# Altium schematic sheet MCUboard.SchDoc
size A; SheetNumber: 1; SheetTotal: 3
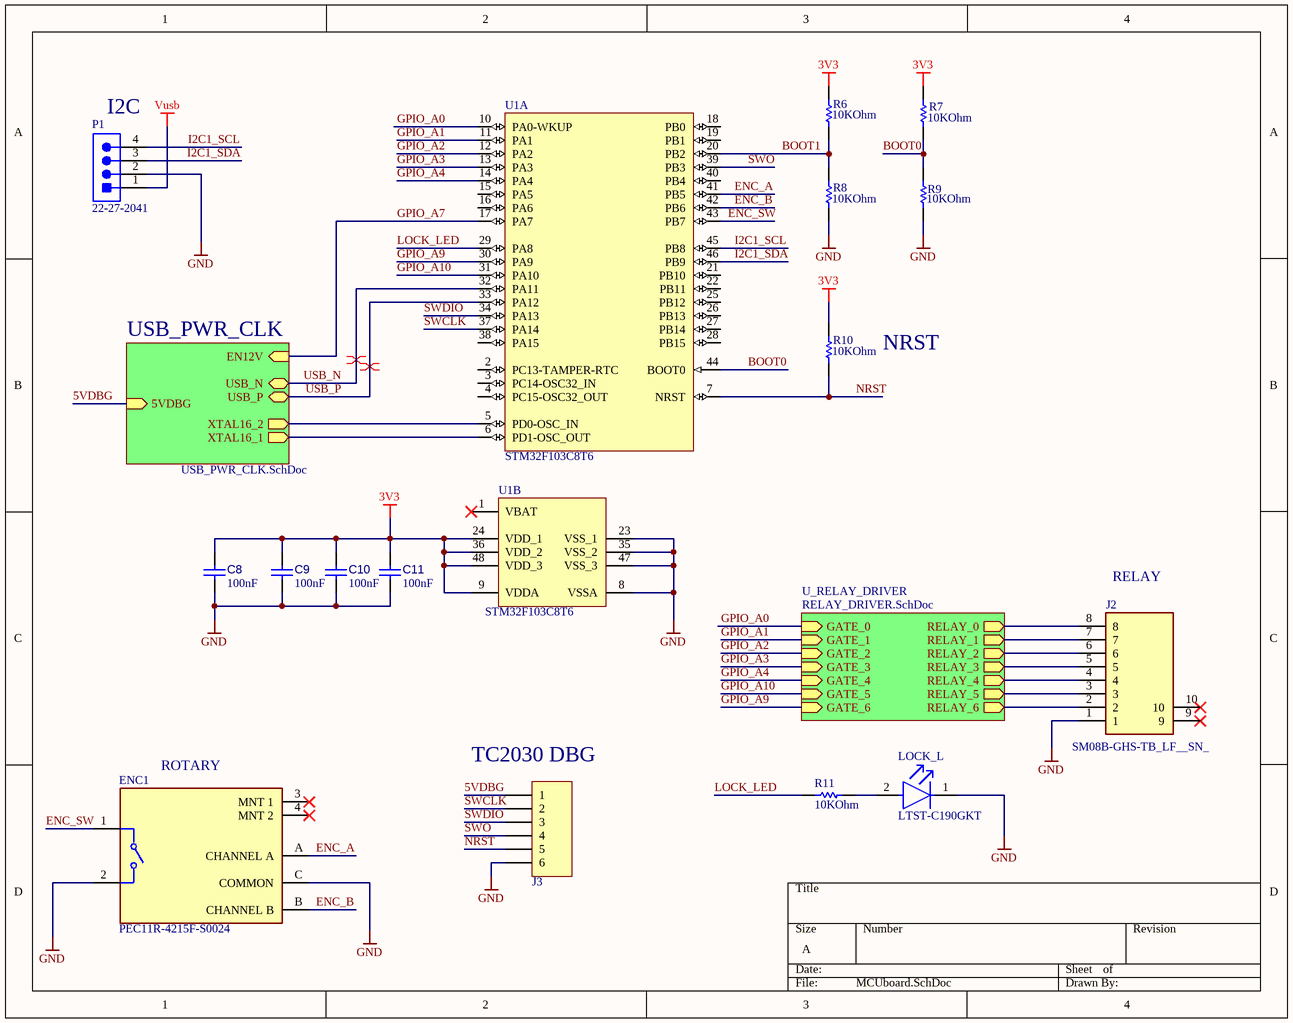
[diagram p0: MCUboard.SchDoc]

## Parts
C8  value 100nF  [CAPC1608X90X40NL10T20]  (hidden comment: Capacitor 100 nF +/-10% 50 V 0603)
C9  value 100nF  [CAPC1608X90X40NL10T20]  (hidden comment: Capacitor 100 nF +/-10% 50 V 0603)
C10  value 100nF  [CAPC1608X90X40NL10T20]  (hidden comment: Capacitor 100 nF +/-10% 50 V 0603)
C11  value 100nF  [CAPC1608X90X40NL10T20]  (hidden comment: Capacitor 100 nF +/-10% 50 V 0603)
ENC1  PEC11R-4215F-S0024  [FP-PEC11R-4215F-S0024-MFG]
J2  SM08B-GHS-TB_LF__SN_  [SM08BGHSTBLFSN]
J3  ICSP  [TC2030-MCP-NL]  (value not drawn)
LOCK_L  LTST-C190GKT  [FP-LTST-C190GKT-MFG]
P1  22-27-2041  [MOLX-22-27-2041_V]
R6  Resistance: 10KOhm  [RESC1609X55X30LL15T15]  (hidden comment: ERJ3EKF1002V)
R7  Resistance: 10KOhm  [RESC1609X55X30LL15T15]  (hidden comment: ERJ3EKF1002V)
R8  Resistance: 10KOhm  [RESC1609X55X30LL15T15]  (hidden comment: ERJ3EKF1002V)
R9  Resistance: 10KOhm  [RESC1609X55X30LL15T15]  (hidden comment: ERJ3EKF1002V)
R10  Resistance: 10KOhm  [RESC1609X55X30LL15T15]  (hidden comment: ERJ3EKF1002V)
R11  Resistance: 10KOhm  [RESC1609X55X30LL15T15]  (hidden comment: ERJ3EKF1002V)
U1  STM32F103C8T6  [STM-LQFP48_L]  (parts A,B of 2)

## Sub-sheets
U_RELAY_DRIVER = RELAY_DRIVER.SchDoc: GATE_0 (in), RELAY_0 (out), GATE_1 (in), RELAY_1 (out), GATE_2 (in), RELAY_2 (out), RELAY_3 (out), RELAY_4 (out), RELAY_5 (out), RELAY_6 (out), GATE_3 (in), GATE_4 (in), GATE_5 (in), GATE_6 (in)
USB_PWR_CLK = USB_PWR_CLK.SchDoc: XTAL16_2 (out), XTAL16_1 (out), USB_N (bidir), USB_P (bidir), EN12V (in), 5VDBG (in)

## Nets
3V3: C8.1 C9.1 C10.1 C11.1 R6.2 R7.2 R10.2 U1.9(VDDA) U1.24(VDD_1) U1.36(VDD_2) U1.48(VDD_3)
GND: C8.2 C9.2 C10.2 C11.2 ENC1.2 ENC1.C(COMMON) J2.1 J3.6 LOCK_L.1(C) P1.2 R8.1 R9.1 U1.8(VSSA) U1.23(VSS_1) U1.35(VSS_2) U1.47(VSS_3)
Vusb: P1.1
5VDBG: J3.1 ; sheet USB_PWR_CLK/5VDBG
BOOT0: R7.1 R9.2 U1.44(BOOT0)
BOOT1: R6.1 R8.2 U1.20(PB2)
ENC_A: ENC1.A(CHANNEL_A) U1.41(PB5)
ENC_B: ENC1.B(CHANNEL_B) U1.42(PB6)
ENC_SW: ENC1.1 U1.43(PB7)
GPIO_A0: U1.10(PA0-WKUP) ; sheet U_RELAY_DRIVER/GATE_0
GPIO_A1: U1.11(PA1) ; sheet U_RELAY_DRIVER/GATE_1
GPIO_A2: U1.12(PA2) ; sheet U_RELAY_DRIVER/GATE_2
GPIO_A3: U1.13(PA3) ; sheet U_RELAY_DRIVER/GATE_3
GPIO_A4: U1.14(PA4) ; sheet U_RELAY_DRIVER/GATE_4
GPIO_A7: U1.17(PA7) ; sheet USB_PWR_CLK/EN12V
GPIO_A9: U1.30(PA9) ; sheet U_RELAY_DRIVER/GATE_6
GPIO_A10: U1.31(PA10) ; sheet U_RELAY_DRIVER/GATE_5
I2C1_SCL: P1.4 U1.45(PB8)
I2C1_SDA: P1.3 U1.46(PB9)
LOCK_LED: R11.2 U1.29(PA8)
NRST: J3.5 R10.1 U1.7(NRST)
SWCLK: J3.2 U1.37(PA14)
SWDIO: J3.3 U1.34(PA13)
SWO: J3.4 U1.39(PB3)
USB_N: U1.32(PA11) ; sheet USB_PWR_CLK/USB_N
USB_P: U1.33(PA12) ; sheet USB_PWR_CLK/USB_P
NetJ2_2: J2.2 ; sheet U_RELAY_DRIVER/RELAY_6
NetJ2_3: J2.3 ; sheet U_RELAY_DRIVER/RELAY_5
NetJ2_4: J2.4 ; sheet U_RELAY_DRIVER/RELAY_4
NetJ2_5: J2.5 ; sheet U_RELAY_DRIVER/RELAY_3
NetJ2_6: J2.6 ; sheet U_RELAY_DRIVER/RELAY_2
NetJ2_7: J2.7 ; sheet U_RELAY_DRIVER/RELAY_1
NetJ2_8: J2.8 ; sheet U_RELAY_DRIVER/RELAY_0
NetLOCK_L_2: LOCK_L.2(A) R11.1
NetU1_5: U1.5(PD0-OSC_IN) ; sheet USB_PWR_CLK/XTAL16_2
NetU1_6: U1.6(PD1-OSC_OUT) ; sheet USB_PWR_CLK/XTAL16_1

Not connected (* = marked no-connect by the designer): ENC1 3(MNT_1)* 4(MNT_2)*; J2 9* 10*; U1 1(VBAT)* 2(PC13-TAMPER-RTC) 3(PC14-OSC32_IN) 4(PC15-OSC32_OUT) 15(PA5) 16(PA6) 18(PB0) 19(PB1) 21(PB10) 22(PB11) 25(PB12) 26(PB13) 27(PB14) 28(PB15) 38(PA15) 40(PB4)

## Layout directives
differential pair; differential pair class USB: USB_N, USB_P

## Notes on the sheet
- (near P1) I2C
- NRST
- (near J2) RELAY
- (near ENC1) ROTARY
- (near J3) TC2030 DBG

## Library data of the parts
C8-C11 = CMP-001-00017-7: Chip Capacitor, 100 nF, +/- 10%, 50 V, 0603 (1608 Metric); Voltage Rating: 50V; Capacitor Type: Ceramic; Tolerance: 10%; Mounting Technology: SM; Max Operating Temperature: 125°C; RoHS Compliant: True; Pins: 2; Case/Package: 0603; Min Operating Temperature: -55°C
ENC1 = CMP-1747-00012-2: ROTARY ENCODER MECHANICAL 24PPR; Hole Diameter: 1.8mm; Output Type: Quadrature; Pulses per Revolution: 24; Number of Channels: 2; Built in Switch: Yes; Min Operating Temperature: -30°C; Series: PEC11R; Type: Mechanical; Package Quantity: 150; Length: 21.5mm; Max Operating Temperature: 70°C; Encoder Type: Mechanical; Height: 13.4mm; Detent: Yes; Packaging: Bulk; Orientation: Vertical; Width: 12.5mm; Termination: PC Pins; Mount: Through Hole; REACH SVHC: No SVHC; Radiation Hardening: No; RoHS Compliant: Yes
J2 = SM08B-GHS-TB_LF__SN_: Connector; Manufacturer_Name: JST (JAPAN SOLDERLESS TERMINALS); Manufacturer_Part_Number: SM08B-GHS-TB(LF)(SN); Datasheet Link: http://www.jst-mfg.com/product/pdf/eng/eGH.pdf; Height: 4.05mm; Arrow Part Number: SM08B-GHS-TB(LF)(SN); Arrow Price/Stock: https://www.arrow.com/en/products/sm08b-ghs-tb-lf-sn/jst-manufacturing
J3 = CMP-008-000000-2: Design Item ID: ICSP; Component Type: Standard; Source: TC2030.SchLib; Pin Count: 5
LOCK_L = CMP-22017-000005-2: LED GREEN CLEAR CHIP SMD; Dominant Wavelength: 569nm; Reverse Voltage: 5V; Lens Color: Colorless; Viewing Angle: 130°; Voltage: 2V; Forward Current: 30mA; Power Dissipation: 100mW; Luminous Intensity: 6mcd; Number of LEDs: 1; Forward Voltage: 2.1V; Wavelength: 565nm; Test Current: 10mA; Min Operating Temperature: -55°C; Lens Style: Clear; Mount: Surface Mount; Width: 0.8mm; Packaging: Tape and Reel; Lens Transparency: Clear; Case Code (Metric): 1608; Depth: 0.8mm; Case Code (Imperial): 0603; Case/Package: 0603; Number of Pins: 2; Max Operating Temperature: 85°C; Lead Free: Lead Free; Number of Elements: 1; Length: 1.6mm; Height: 0.8mm; Package Quantity: 1; Power Rating: 100mW; Radiation Hardening: No; Illumination Color: Green; Color: Green
P1 = CMP-2000-05243-1: Male Header, Pitch 2.54 mm, 1 x 4 Position, Height 11.7 mm, Tail Length 3.56 mm, RoHS, Bulk; Manufacturer: Molex; Voltage rating: 250V; Current rating: 4A; Datasheet Version: Rev. F, 06/2009; Operating temperature: 0degCto+75degC; Contact material: Tinplatedbrass; Manufacturer URL: http://www.molex.com/; Housing material: Nylon(UL94V-0); Datasheet URL: http://www.molex.com/pdm_docs/sd/022272041_sd.pdf
R6-R11 = CMP-1012-00623-3: Chip Resistor, 10 KOhm, +/- 1%, 0.1 W, -55 to 155 degC, 0603 (1608 Metric), RoHS, Tape and Reel; Manufacturer: Panasonic; Voltage Rating: 75V; Case\/Package: 0603; Power Rating: 100mW; Temperature Coefficient: 100ppm\/degreesC; Number of Pins: 2; Package Reference: 603; Depth: 0.8mm; Mount: SurfaceMount; Package Description: 2-Pin Surface Mount Device, Body 1.6 x 0.85 mm; Datasheet Version: 02/2017; Length: 1.6mm; Lead Free: LeadFree; Height: 0.45mm; Number of Terminations: 2; Max Power Dissipation: 100mW; Min Operating Temperature: -55degC; Datasheet URL: https://industrial.panasonic.com/cdbs/www-data/pdf/RDA0000/AOA0000C304.pdf; Termination: SMD/SMT; Case Code (Metric): 1608; Case Code (Imperial): 0603; Tolerance: 1%; Max Operating Temperature: 155degC; RoHSCompliant: true; Voltage Rating (DC): 75V; Radiation Hardening: No; Packaging: TapeandReel; Composition: ThickFilm; Mounting Technology: SurfaceMount; Manufacturer URL: http://www.panasonic.com/; Width: 0.031inch; REACH SVHC: NoSVHC; Contact Plating: Tin; Military Standard: Not; Package Quantity: 1
U1 = CMP-0237-00215-3: ARM Cortex-M3 32-bit MCU, 64 KB Flash, 20 KB Internal RAM, 37 I/Os, 48-pin LQFP, -40 to 85 degC, Tray; Supply Voltage(Vcc) min (V): 2; Internal RAM Size (kB): 20; FLASH Size (Prog) (kB): 64; A/D Converter: 2x12-bit (10 Channel); I/Os (High Current): 37; Operating Frequency(F) (Processor speed) (MHz): 72; Core: ARM Cortex-M3; ComponentLink3Description: Package Specification; Mounting Technology: Surface Mount; PartNumber: STM32F103C8T6; PackageReference: LQFP48; Packing: Tray; ComponentLink3URL: http://www.st.com/st-web-ui/static/active/en/resource/technical/document/datasheet/DM00058181.pdf; DatasheetVersion: Rev. 16; ComponentLink1URL: http://www.st.com/web/en/home.html; PackageVersion: Rev. 6, 06/2013; ComponentLink2URL: http://www.st.com/st-web-ui/static/active/en/resource/technical/document/datasheet/CD00161566.pdf; ComponentLink1Description: Manufacturer URL; ComponentLink2Description: Datasheet; PackageDescription: 48-Pin Low Profile Quad Flat Package, 7 x 7 mm Body, 0.5 mm Pitch